# Altium project Featured_Tag_RBS020902T.PrjPCB
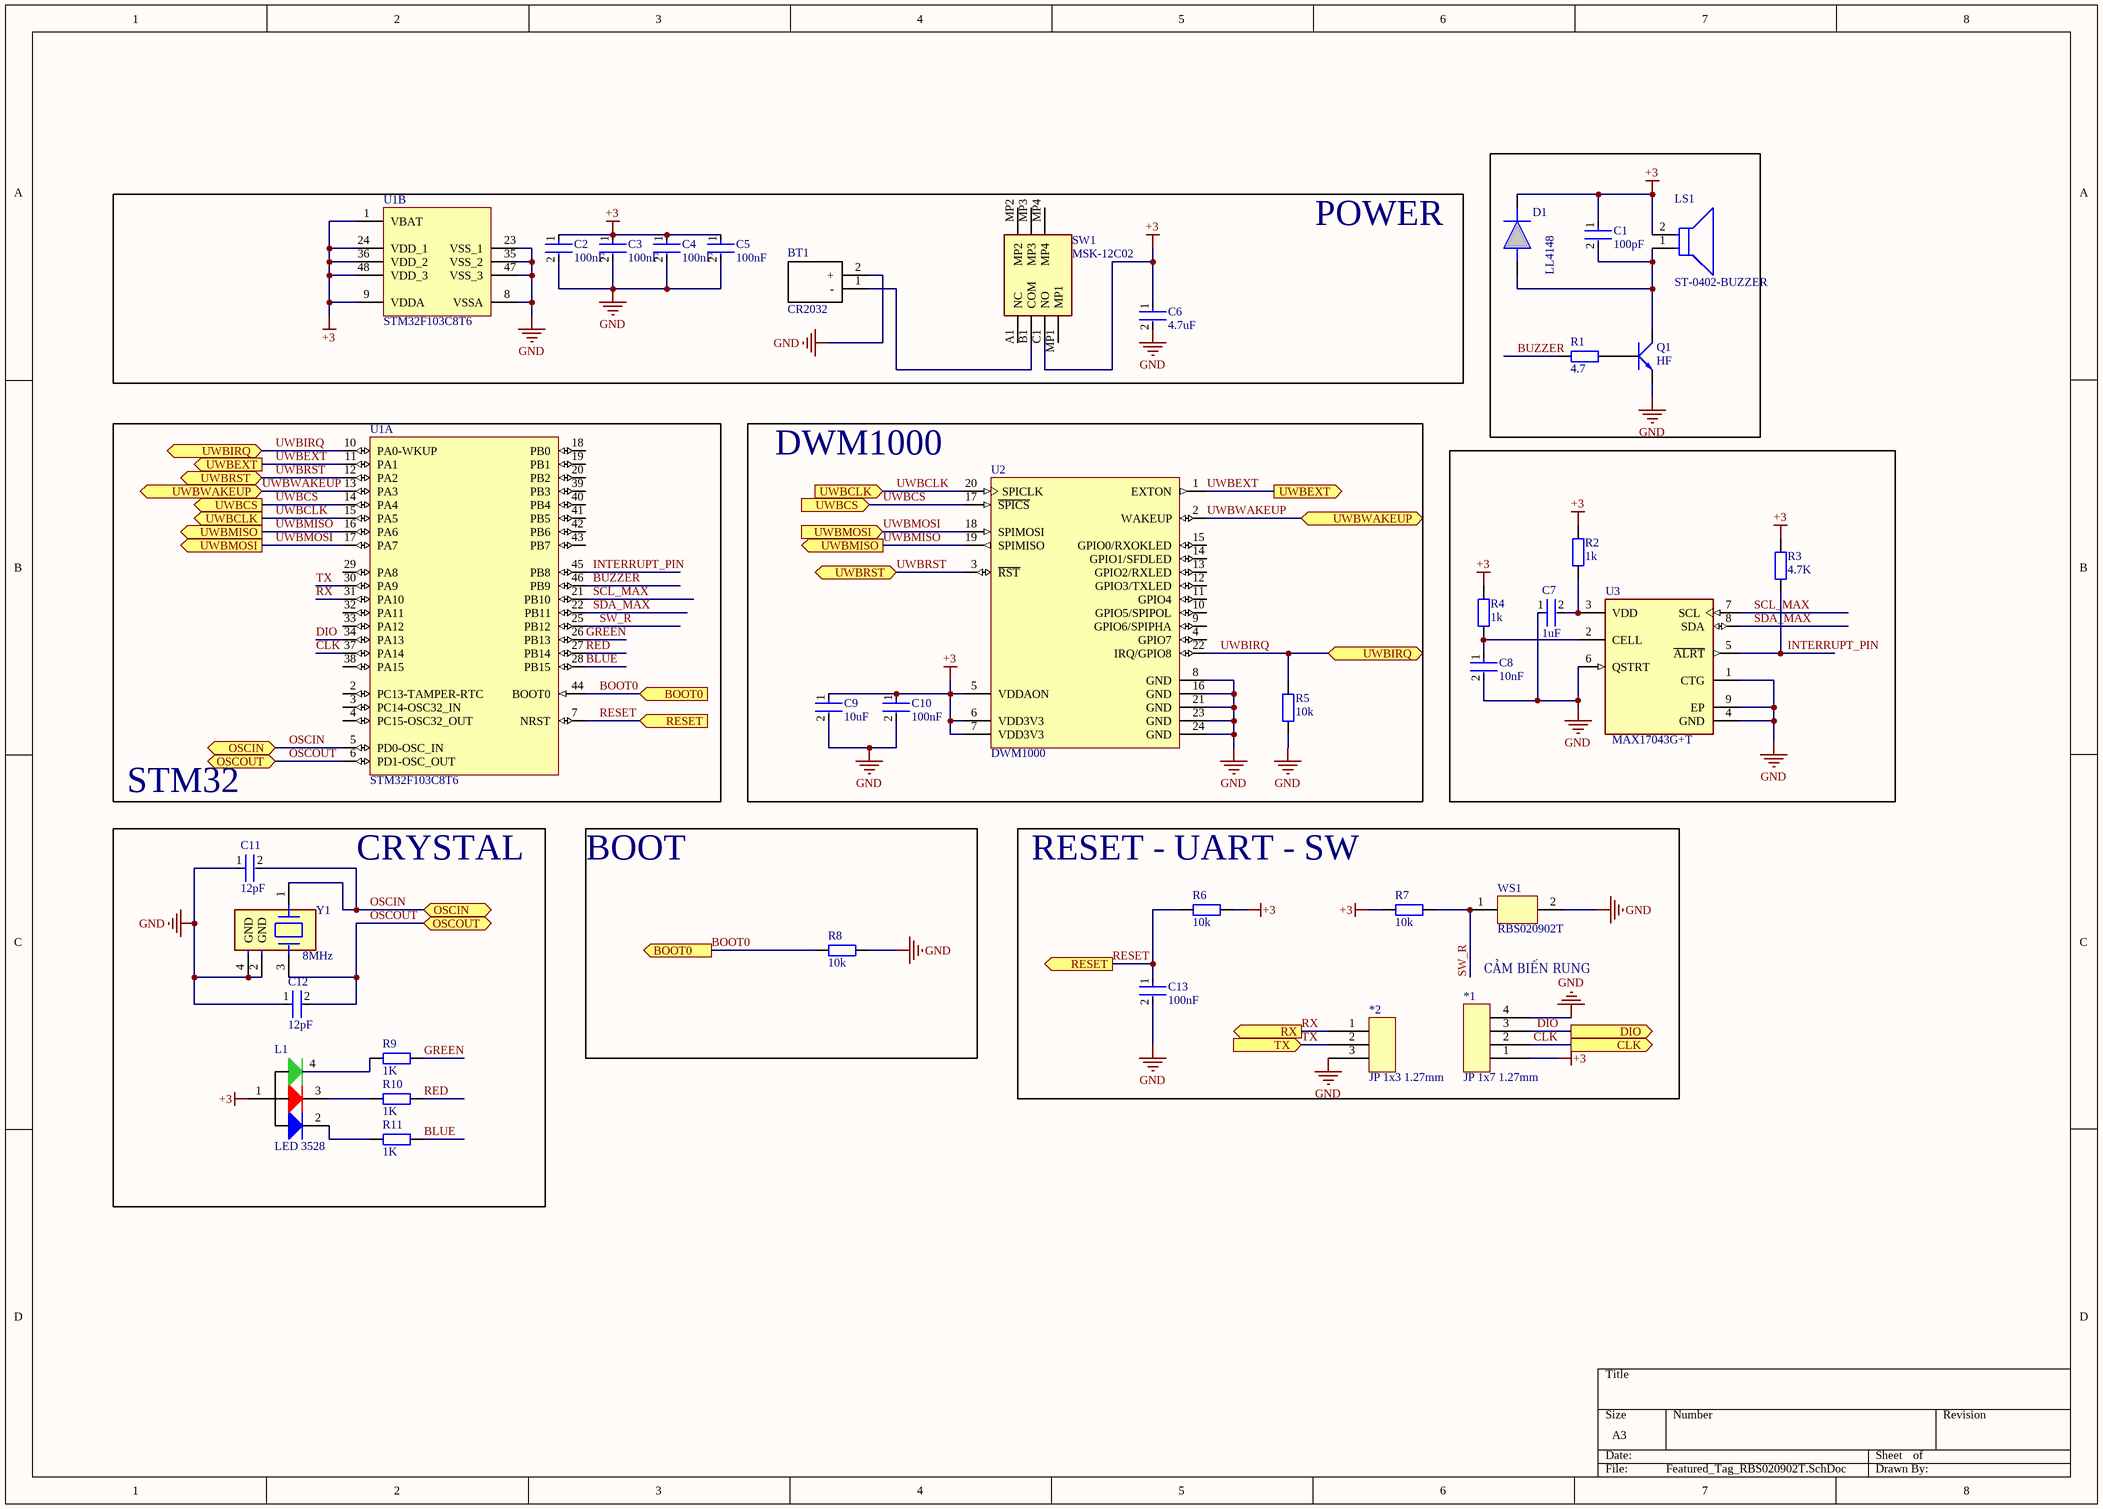
[diagram p0: Featured_Tag_RBS020902T.SchDoc]
1 sheet, 37 parts. Net scope: flat (ports and power ports of the same name join across sheets).
Board file: Featured_Tag_RBS020902T.PcbDoc

## Sheet Featured_Tag_RBS020902T.SchDoc
size A3

### Parts
*1  JP 1x7 1.27mm  [JP 1x4 1.27mm]
*2  JP 1x3 1.27mm  [JP 1x3 1.27mm]
BT1  CR2032  [CR2450NFHLF]
C1  100pF  [FP-0603-L_1_6_0_15-W_0_81-MFG]
C2  100nF  [FP-0603-L_1_6_0_15-W_0_81-MFG]
C3  100nF  [FP-0603-L_1_6_0_15-W_0_81-MFG]
C4  100nF  [FP-0603-L_1_6_0_15-W_0_81-MFG]
C5  100nF  [FP-0603-L_1_6_0_15-W_0_81-MFG]
C6  4.7uF  [FP-0603-L_1_6_0_15-W_0_81-MFG]
C7  1uF  [FP-0603-L_1_6_0_15-W_0_81-MFG]
C8  10nF  [FP-0603-L_1_6_0_15-W_0_81-MFG]
C9  10uF  [FP-0603-L_1_6_0_15-W_0_81-MFG]
C10  100nF  [FP-0603-L_1_6_0_15-W_0_81-MFG]
C11  12pF  [FP-0603-L_1_6_0_15-W_0_81-MFG]
C12  12pF  [FP-0603-L_1_6_0_15-W_0_81-MFG]
C13  100nF  [FP-0603-L_1_6_0_15-W_0_81-MFG]
D1  LL4148  [SOD-80]
L1  LED 3528  [LED RGB 3528]
LS1  ST-0402-BUZZER  [FP-ST-0402T-MFG]
Q1  HF  [SOT23]
R1  4.7  [tro smd 0603]
R2  1k  [tro smd 0603]
R3  4.7K  [tro smd 0603]
R4  1k  [tro smd 0603]
R5  10k  [tro smd 0603]
R6  10k  [tro smd 0603]
R7  10k  [tro smd 0603]
R8  10k  [tro smd 0603]
R9  1K  [tro smd 0603]
R10  1K  [tro smd 0603]
R11  1K  [tro smd 0603]
SW1  MSK-12C02  [sw_msk_12c02]
U1  STM32F103C8T6  [STM-LQFP48_L]  (parts A,B of 2)
U2  DWM1000  [DECW-DWM1000-24_V]
U3  MAX17043G+T  [FP-T823-1-MFG]
WS1  RBS020902T  [RBS020902T]
Y1  8MHz  [FP-7M-MFG]

### Blocks framed on the sheet
POWER: BT1 C2-C6 SW1 U1
STM32: U1
DWM1000: C9 C10 R5 U2
CRYSTAL: C11 C12 L1 R9-R11 Y1
BOOT: R8
RESET - UART - SW: *1 *2 C13 R6 R7 WS1

### Ports
BOOT0 (in), BOOT0 (out), CLK (out), DIO (out), OSCIN (bidir), OSCOUT (bidir), RESET (in), RESET (out), RX (out), TX (in), UWBCLK (in), UWBCLK (out), UWBCS (in), UWBCS (out), UWBEXT (out), UWBIRQ (bidir), UWBMISO (out), UWBMOSI (in), UWBMOSI (out), UWBRST (bidir), UWBWAKEUP (bidir)

### Nets
+3: *1.1 C1.1 C2.1 C3.1 C4.1 C5.1 C6.1 C9.1 C10.1 D1.1(K) L1.1 LS1.2(A) R2.2 R3.2 R4.2 R6.1 R7.2 SW1.C1(NO) U1.1(VBAT) U1.9(VDDA) U1.24(VDD_1) U1.36(VDD_2) U1.48(VDD_3) U2.5(VDDAON) U2.6(VDD3V3) U2.7(VDD3V3)
GND: *1.4 *2.3 BT1.2(+) C2.2 C3.2 C4.2 C5.2 C6.2 C7.1 C8.2 C9.2 C10.2 C11.1 C12.1 C13.2 Q1.2(E) R5.1 R8.1 U1.8(VSSA) U1.23(VSS_1) U1.35(VSS_2) U1.47(VSS_3) U2.8(GND) U2.16(GND) U2.21(GND) U2.23(GND) U2.24(GND) U3.1(CTG) U3.4(GND) U3.6(QSTRT) U3.9(EP) WS1.2 Y1.2(GND) Y1.4(GND)
BLUE: R11.2 U1.28(PB15)
BOOT0: R8.2 U1.44(BOOT0) ; port BOOT0
BUZZER: R1.2 U1.46(PB9)
CLK: *1.2 U1.37(PA14) ; port CLK
DIO: *1.3 U1.34(PA13) ; port DIO
GREEN: R9.2 U1.26(PB13)
INTERRUPT_PIN: R3.1 U1.45(PB8) U3.5(~{ALRT})
OSCIN: C11.2 U1.5(PD0-OSC_IN) Y1.1 ; port OSCIN
OSCOUT: C12.2 U1.6(PD1-OSC_OUT) Y1.3 ; port OSCOUT
RED: R10.2 U1.27(PB14)
RESET: C13.1 R6.2 U1.7(NRST) ; port RESET
RX: *2.1 U1.31(PA10) ; port RX
SCL_MAX: U1.21(PB10) U3.7(SCL)
SDA_MAX: U1.22(PB11) U3.8(SDA)
SW_R: R7.1 U1.25(PB12) WS1.1
TX: *2.2 U1.30(PA9) ; port TX
UWBCLK: U1.15(PA5) U2.20(SPICLK) ; port UWBCLK
UWBCS: U1.14(PA4) U2.17(~{SPICS}) ; port UWBCS
UWBEXT: U1.11(PA1) U2.1(EXTON) ; port UWBEXT
UWBIRQ: R5.2 U1.10(PA0-WKUP) U2.22(IRQ/GPIO8) ; port UWBIRQ
UWBMISO: U1.16(PA6) U2.19(SPIMISO) ; port UWBMISO
UWBMOSI: U1.17(PA7) U2.18(SPIMOSI) ; port UWBMOSI
UWBRST: U1.12(PA2) U2.3(~{RST}) ; port UWBRST
UWBWAKEUP: U1.13(PA3) U2.2(WAKEUP) ; port UWBWAKEUP
NetBT1_1: BT1.1(-) SW1.B1(COM)
NetC1_2: C1.2 D1.2(A) LS1.1(C) Q1.3(C)
NetC7_2: C7.2 R2.1 U3.3(VDD)
NetC8_1: C8.1 R4.1 U3.2(CELL)
NetL1_2: L1.2 R11.1
NetL1_3: L1.3 R10.1
NetL1_4: L1.4 R9.1
NetQ1_1: Q1.1(B) R1.1

Not connected (* = marked no-connect by the designer): SW1 A1(NC) MP1 MP2 MP3 MP4; U1 2(PC13-TAMPER-RTC) 3(PC14-OSC32_IN) 4(PC15-OSC32_OUT) 18(PB0) 19(PB1) 20(PB2) 29(PA8) 32(PA11) 33(PA12) 38(PA15) 39(PB3) 40(PB4) 41(PB5) 42(PB6) 43(PB7); U2 4(GPIO7) 9(GPIO6/SPIPHA) 10(GPIO5/SPIPOL) 11(GPIO4) 12(GPIO3/TXLED) 13(GPIO2/RXLED) 14(GPIO1/SFDLED) 15(GPIO0/RXOKLED)

### Notes on the sheet
- CẢM BIẾN RUNG

### Library data of the parts
BT1 = CR2450NFH-LF: Battery; Manufacturer_Name: RENATA; Datasheet Link: https://www.renata.com/fileadmin/downloads/productsheets/lithium/tabbed_lithium/tab_2pins_horizontal/CR2450NFH-LF.pdf; Height: 5mm; Manufacturer_Part_Number: CR2450NFH-LF; Mouser Part Number: 614-CR2450NFH-LF; Mouser Price/Stock: https://www.mouser.co.uk/ProductDetail/Renata/CR2450NFH-LF/?qs=xQKTP3rDTQhL%252B2W8VgWSZA%3D%3D
C1-C13 = CMP-2006-04515-2: General Purpose Ceramic Capacitor, 0603, 33nF, 5%, X7R, 15%, 16V; Dissipation Factor: 3.5%; Packaging: Tape and Reel; Construction: Flat; Case/Package: 0603; Package Quantity: 4000; Number of Pins: 2; RoHS Compliant: Yes; Voltage Rating: 16V; Termination: SMD/SMT; Case Code (Imperial): 0603; Max Operating Temperature: 125°C; Length: 1.6mm; Capacitance: 33nF; Voltage Rating (DC): 16V; Mount: Surface Mount; Series: -; Width: 0.032inch; Dielectric: X7R; Radiation Hardening: No; Min Operating Temperature: -55°C; Case Code (Metric): 1608; Thickness: 0.035inch; Depth: 0.81mm; Tolerance: 5%
D1 = LL4148-GS18: Vishay LL4148-GS18 Switching Diode, 300mA, 2-Pin MiniMELF; Manufacturer_Name: Vishay; Manufacturer_Part_Number: LL4148-GS18; Mouser Part Number: 78-LL4148-GS18; Mouser Price/Stock: https://www.mouser.co.uk/ProductDetail/Vishay-Semiconductors/LL4148-GS18?qs=YkIJFe%252BtFEUsKqcD4T1jvg%3D%3D; Arrow Part Number: LL4148-GS18; Arrow Price/Stock: https://www.arrow.com/en/products/ll4148-gs18/vishay?region=nac; Mouser Testing Part Number: *; Mouser Testing Price/Stock: *; Datasheet Link: https://www.vishay.com/docs/85557/ll4148.pdf
L1 = LED 3528 RGB: Dán; Don_Vi: Con; Ma_Hang: MH007160; Ghi_Chu: *; Kieu_Chan: *; Chung_Loai: Dán; Ten_Linh_Kien: LED3528 RGB
LS1 = CMP-247804-000001-1: AUDIO MAGNETIC XDCR 2-4V SMD; Manufacturer: Soberton Inc.; Manufacturer Part Number: ST-0402T; Resistance: 17Ω; Min Supply Voltage: 2V; Frequency: 4kHz; Value: 17Ω; Current: 90mA; Operating Supply Voltage: 3V; Max Supply Voltage: 4V; Height: 2.5mm; Temperature: -30°C to +70°C; Device Class L1: Electromechanical; Digikey Description: AUDIO MAGNETIC XDCR 2-4V SMD; Temperature Range High: +70°C; Lead Free: Yes; Package: ST-0402T; Category: Speak; Device Class L2: Audio Products; Automotive: No; ComponentLink2URL: https://www.soberton.com/wp-content/uploads/2019/02/ST-0402T-19-Feb-2019.pdf; ComponentLink2Description: Datasheet; Device Class L3: Buzzers; Octopart: https://octopart.com/st-0402t-soberton-60771822; Temperature Range Low: -30°C; RoHS: TRUE
Q1 = C1815 HF SMD: NPN transistor; Value: C9014
R1-R4 = Tro 0603 5% 1k: Dán; Don_Vi: Con; So_Chan: 2; Ten_Linh_Kien: Trở 0603 5% 1k; Ma_Hang: MH006319; Chung_Loai: Dán; Kieu_Chan: *
R5-R8 = Tro 0603 5% 10k: Dán; Don_Vi: Con; So_Chan: 2; Ten_Linh_Kien: Trở 0603 5% 10k; Ma_Hang: MH006316; Chung_Loai: Dán; Kieu_Chan: *
R9 R11 = Tro 0603 5% 100R: Dán; Don_Vi: Con; So_Chan: 2; Ten_Linh_Kien: Trở 0603 5% 100R; Ma_Hang: MH006315; Chung_Loai: Dán; Kieu_Chan: *
R10 = Tro 0603 5% 150R: Dán; Don_Vi: Con; So_Chan: 2; Ten_Linh_Kien: Trở 0603 5% 150R; Ma_Hang: MH006318; Chung_Loai: Dán; Kieu_Chan: *
U1 = CMP-0237-00215-3: ARM Cortex-M3 32-bit MCU, 64 KB Flash, 20 KB Internal RAM, 37 I/Os, 48-pin LQFP, -40 to 85 degC, Tray; Supply Voltage(Vcc) min (V): 2; Internal RAM Size (kB): 20; FLASH Size (Prog) (kB): 64; A/D Converter: 2x12-bit (10 Channel); I/Os (High Current): 37; Operating Frequency(F) (Processor speed) (MHz): 72; Core: ARM Cortex-M3; ComponentLink3Description: Package Specification; Mounting Technology: Surface Mount; PartNumber: STM32F103C8T6; PackageReference: LQFP48; Packing: Tray; ComponentLink3URL: http://www.st.com/st-web-ui/static/active/en/resource/technical/document/datasheet/DM00058181.pdf; DatasheetVersion: Rev. 16; ComponentLink1URL: http://www.st.com/web/en/home.html; PackageVersion: Rev. 6, 06/2013; ComponentLink2URL: http://www.st.com/st-web-ui/static/active/en/resource/technical/document/datasheet/CD00161566.pdf; ComponentLink1Description: Manufacturer URL; ComponentLink2Description: Datasheet; PackageDescription: 48-Pin Low Profile Quad Flat Package, 7 x 7 mm Body, 0.5 mm Pitch; ComponentLink4Description: New link; ComponentLink4URL: https://www.mouser.vn/ProductDetail/STMicroelectronics/STM32F103C8T6?qs=bhCVus9SdFtq6kqxsU5%2FDA%3D%3D; ComponentLink5Description: New link; ComponentLink5URL: 7.63$
U2 = CMP-2000-05094-1: DW M1000 IEEE 802.15.4 -2011 UWB Transceiver Module; Manufacturer: Decawave; Voltage - Supply: 2.8V~3.6V; Protocol: IR-UWB; Featured Product: ScenSorDWM1000Module; Design Resources: DevelopmentToolSelector; Frequency: 3.5GHz~6.5GHz; Antenna Type: Integrated,Chip; Other Names: 1479-1002-2RUPF-G001A; Current - Receiving: 64mA; Data Rate: 6.8Mbps; Serial Interfaces: SPI; Current - Transmitting: 31mA; Modulation: BPM,BPSK; Standard Package: 500; Series: -; RF Family/Standard: 802.15.4; Operating Temperature: -40degC~85degC; Sensitivity: -; Packaging: Tape&Reel(TR); Datasheet Version: Rev. V1.0, 12/2015; Power - Output: -; Family: RFTransceiverModules; Memory Size: -; Package / Case: Module; Mounting Type: SurfaceMount; Datasheet URL: http://www.decawave.com/sites/default/files/resources/dwm1000-datasheet-v1.3.pdf; Online Catalog: ScenSorDWM1000Module; Category: RF/IFandRFID; Manufacturer URL: http://www.decawave.com/; ComponentLink1Description: New link; ComponentLink1URL: https://www.mouser.vn/ProductDetail/Qorvo/DWM1000?qs=sGAEpiMZZMu3sxpa5v1qrrjDD2pjKdCcRPXEFIZh8rA%3D; ComponentLink2Description: New link; ComponentLink2URL: 16.67$
U3 = CMP-05715-000066-1: IC 2-WIRE FG MODEL GAUGE LO BATT; Manufacturer: Maxim; Max Supply Voltage: 4.5V; Standoff Height: 0mm; Nominal Supply Current: 50uA; Min Supply Voltage: 2.5V; Number Of Cells: 1; Height: 0.8mm; Device Class L3: Battery Management; Package: T823-1; Footprint Url: https://pdfserv.maximintegrated.com/land_patterns/90-0091.PDF; ComponentLink2Description: Datasheet; Lead Free: Yes; RoHS: TRUE; Mouser Description: Battery Management Over Volt Protector Ideal Diode; Digikey Description: IC 2-WIRE FG MODEL GAUGE LO BATT; Device Class L1: Integrated Circuits (ICs); Manufacturer Part Number: MAX17043G+T; Temperature: -20°C to +70°C; Automotive: No; ComponentLink2URL: https://datasheets.maximintegrated.com/en/ds/MAX17043-MAX17044.pdf; Device Class L2: Power Management ICs; Octopart: https://octopart.com/max17043g%2Bt-maxim+integrated-43979038; Category: IC; Temperature Range High: +70°C; Temperature Range Low: -20°C
Y1 = CMP-18717-000290-1: Crystal 26MHz, 30ppm, 18pF, 50Ω; ESR (Equivalent Series Resistance): 60R; Depth: 2.5mm; Length: 3.2mm; Load Capacitance: 18pF; Package Quantity: 3000; Number of Pins: 4; Packaging: Tape and Reel; Mount: Surface Mount; Termination: SMD/SMT; Tolerance: 30ppm; Series: 7M; Case/Package: SMD/SMT; Frequency Tolerance: 30ppm; REACH SVHC: No SVHC; Min Operating Temperature: -20°C; Frequency Stability: 30ppm; Width: 0.098inch; Max Operating Temperature: 70°C; Height: 0.031inch; Frequency: 26MHz